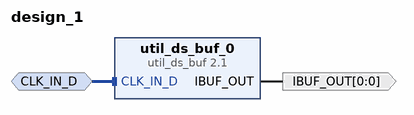
[diagram p0: block diagram of the top level]
# Vivado block design design_1, Vivado 2016.2
create_bd_design design_1

create_bd_intf_port -mode Slave -vlnv xilinx.com:interface:diff_clock_rtl:1.0 CLK_IN_D
create_bd_port -dir O -from 0 -to 0 IBUF_OUT

create_bd_cell -type ip -vlnv xilinx.com:ip:util_ds_buf:2.1 util_ds_buf_0
set_property -dict {CONFIG.C_BUF_TYPE IBUFDSGTE} [get_bd_cells util_ds_buf_0]

# ---- connections ----

connect_bd_intf_net [get_bd_intf_ports CLK_IN_D] [get_bd_intf_pins util_ds_buf_0/CLK_IN_D]
connect_bd_net [get_bd_pins util_ds_buf_0/IBUF_OUT] [get_bd_ports IBUF_OUT]

validate_bd_design
save_bd_design
